# Altium schematic sheet sensores.SchDoc
size A4; SheetNumber: 2; SheetTotal: 2
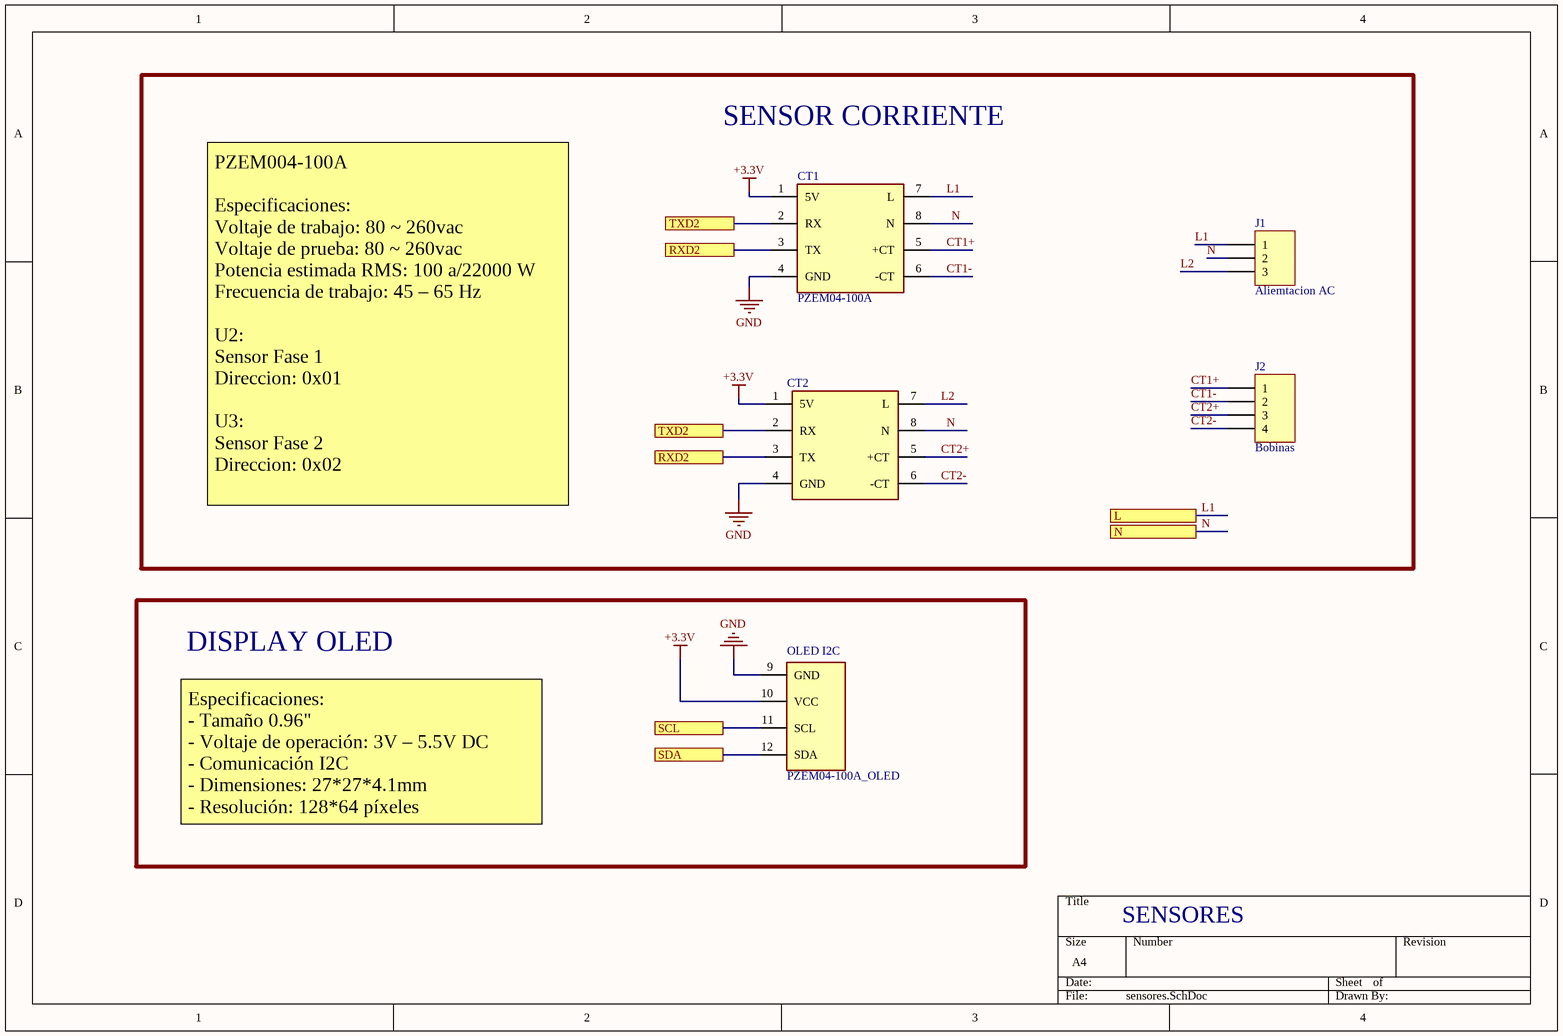
[diagram p0: sensores.SchDoc]

## Parts
CT1  PZEM04-100A  [FP-PZEM-004-100A]
CT2  PZEM04-100A_OLED  [PZEM100A-OLED]
J1  Aliemtacion AC  [Bornera 3]
J2  Bobinas  [BORNERA 4]

## Blocks framed on the sheet
SENSOR CORRIENTE: CT1 CT2 J1 J2

## Ports
L, N, RXD2, SCL, SDA, TXD2

## Nets
+3.3V: CT1.1(5V) CT2.1(5V) CT2.10(VCC)
GND: CT1.4(GND) CT2.4(GND) CT2.9(GND)
CT1+: CT1.5(+CT) J2.1
CT1-: CT1.6(-CT) J2.2
CT2+: CT2.5(+CT) J2.3
CT2-: CT2.6(-CT) J2.4
L1: CT1.7(L) J1.1 ; port L
L2: CT2.7(L) J1.3
N: CT1.8(N) CT2.8(N) J1.2 ; port N
RXD2: CT1.3(TX) CT2.3(TX) ; port RXD2
SCL: CT2.11(SCL) ; port SCL
SDA: CT2.12(SDA) ; port SDA
TXD2: CT1.2(RX) CT2.2(RX) ; port TXD2

## Notes on the sheet
- PZEM004-100A
  Especificaciones:
  Voltaje de trabajo: 80 ~ 260vac
  Voltaje de prueba: 80 ~ 260vac
  Potencia estimada RMS: 100 a/22000 W
  Frecuencia de trabajo: 45 – 65 Hz
  U2:
  Sensor Fase 1
  Direccion: 0x01
  U3:
  Sensor Fase 2
  Direccion: 0x02
- DISPLAY OLED
- Especificaciones:
  - Tamaño 0.96"
  - Voltaje de operación: 3V – 5.5V DC
  - Comunicación I2C
  - Dimensiones: 27*27*4.1mm
  - Resolución: 128*64 píxeles
- SENSORES
- (in symbol PZEM04-100A_OLED) OLED I2C

## Library data of the parts
CT1 = PZEM04-100A: Sensor Pzem004 Version 100A
CT2 = PZEM04-100A_OLED: Sensor Pzem004 Version 100A / OLED I2C 0.96
J1 = Conector 3
J2 = Conector 4